# Altium schematic sheet UNIDOCK SIMPLE_2020-10-20_22-44-49.schdoc
size 286 x 136 mm
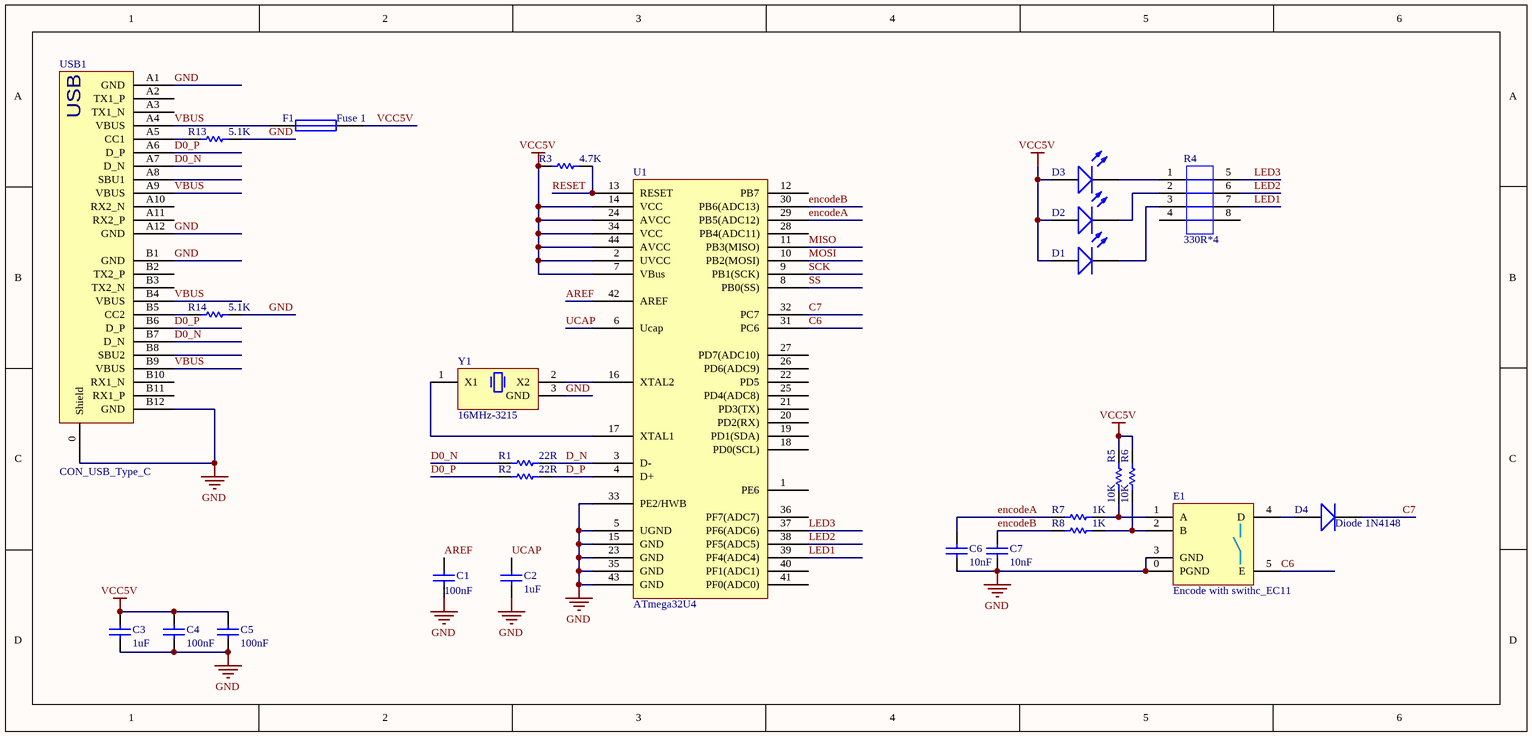
[diagram p0: UNIDOCK SIMPLE_2020-10-20_22-44-49.schdoc]

## Parts
C1  100nF  [CAPC1005L[0402]]
C2  1uF  [CAPC1005L[0402]]
C3  1uF  [CAPC1005L[0402]]
C4  100nF  [CAPC1005L[0402]]
C5  100nF  [CAPC1005L[0402]]
C6  10nF  [CAPC1005L[0402]]
C7  10nF  [CAPC1005L[0402]]
D1  LED0  [DIODE2012L[0805]]  (value not drawn)
D2  LED0  [DIODE2012L[0805]]  (value not drawn)
D3  LED0  [DIODE2012L[0805]]  (value not drawn)
D4  Diode 1N4148  [DIODE2012L[0805]]
E1  Encode with swithc_EC11  [ENCODE WITH SWITCH-EC11]
F1  Fuse 1  [CAPC1608L[0603]]
R1  22R  [RESC1005L[0402]]
R2  22R  [RESC1005L[0402]]
R3  4.7K  [RESC1005L[0402]]
R4  330R*4  [RES*4_0402]
R5  10K  [RESC1005L[0402]]
R6  10K  [RESC1005L[0402]]
R7  1K  [RESC1005L[0402]]
R8  1K  [RESC1005L[0402]]
R13  5.1K  [RESC1005L[0402]]
R14  5.1K  [RESC1005L[0402]]
U1  ATmega32U4  [44M_M]
USB1  CON_USB_Type_C  [CON_USB_TYPE-C_3.0]
Y1  16MHz-3215  [CRYSTAL SMD 3215]

## Nets
GND: C1.1 C2.2 C3.2 C4.2 C5.2 C6.1 C7.1 E1.0(PGND) E1.3(GND) R13.2 R14.2 U1.5(UGND) U1.15(GND) U1.23(GND) U1.33(PE2/HWB) U1.35(GND) U1.43(GND) USB1.0(Shield) USB1.A1(GND) USB1.A12(GND) USB1.B1(GND) USB1.B12(GND) Y1.3(GND)
VCC5V: C3.1 C4.1 C5.1 D1.1(A) D2.1(A) D3.1(A) F1.2 R3.1 R5.2 R6.2 U1.2(UVCC) U1.7(VBus) U1.14(VCC) U1.24(AVCC) U1.34(VCC) U1.44(AVCC)
AREF: C1.2 U1.42(AREF)
C6: E1.5(E) U1.31(PC6)
C7: D4.2(K) U1.32(PC7)
D0_N: R1.2 USB1.A7(D_N) USB1.B7(D_N)
D0_P: R2.2 USB1.A6(D_P) USB1.B6(D_P)
D_N: R1.1 U1.3(D-)
D_P: R2.1 U1.4(D+)
encodeA: C6.2 R7.1 U1.29(PB5(ADC12))
encodeB: C7.2 R8.1 U1.30(PB6(ADC13))
LED1: R4.7 U1.39(PF4(ADC4))
LED2: R4.6 U1.38(PF5(ADC5))
LED3: R4.5 U1.37(PF6(ADC6))
MISO: U1.11(PB3(MISO))
MOSI: U1.10(PB2(MOSI))
RESET: R3.2 U1.13(RESET)
SCK: U1.9(PB1(SCK))
SS: U1.8(PB0(SS))
UCAP: C2.1 U1.6(Ucap)
VBUS: F1.1 USB1.A4(VBUS) USB1.A9(VBUS) USB1.B4(VBUS) USB1.B9(VBUS)
NetD1_2: D1.2(K) R4.3
NetD2_2: D2.2(K) R4.2
NetD3_2: D3.2(K) R4.1
NetD4_1: D4.1(A) E1.4(D)
NetE1_1: E1.1(A) R5.1 R7.2
NetE1_2: E1.2(B) R6.1 R8.2
NetR13_1: R13.1 USB1.A5(CC1)
NetR14_1: R14.1 USB1.B5(CC2)
NetU1_16: U1.16(XTAL2) Y1.2(X2)
NetU1_17: U1.17(XTAL1) Y1.1(X1)

Not connected (* = marked no-connect by the designer): R4 4 8; U1 1(PE6) 12(PB7) 18(PD0(SCL)) 19(PD1(SDA)) 20(PD2(RX)) 21(PD3(TX)) 22(PD5) 25(PD4(ADC8)) 26(PD6(ADC9)) 27(PD7(ADC10)) 28(PB4(ADC11)) 36(PF7(ADC7)) 40(PF1(ADC1)) 41(PF0(ADC0)); USB1 A2(TX1_P) A3(TX1_N) A8(SBU1) A10(RX2_N) A11(RX2_P) B2(TX2_P) B3(TX2_N) B8(SBU2) B10(RX1_N) B11(RX1_P)

## Notes on the sheet
- (in symbol CON_USB_Type_C) USB

## Library data of the parts
C1 C4 C5 = 100nF: Published: 8-Jun-2000; LatestRevisionDate: 17-Jul-2002; LatestRevisionNote: Re-released for DXP Platform.; PackageReference: RAD-0.3; Publisher: Altium Limited
C2 C3 = 1uF: Published: 8-Jun-2000; LatestRevisionDate: 17-Jul-2002; LatestRevisionNote: Re-released for DXP Platform.; PackageReference: RAD-0.3; Publisher: Altium Limited
C6 C7 = 10nF: Published: 8-Jun-2000; LatestRevisionDate: 17-Jul-2002; LatestRevisionNote: Re-released for DXP Platform.; PackageReference: RAD-0.3; Publisher: Altium Limited
D1-D3 = LED0: Published: 8-Jun-2000; LatestRevisionDate: 08-Jul-2005; LatestRevisionNote: Mech Layer 1 removed.; PackageReference: LED-0; Publisher: Altium Limited
D4 = Diode 1N4148: Published: 8-Jun-2000; LatestRevisionDate: 17-Jul-2002; LatestRevisionNote: Re-released for DXP Platform.; DatasheetVersion: 1997; PackageReference: DO-35; Publisher: Altium Limited; Code_JEDEC: DO-204-AH; ComponentLink1Description: Manufacturer Link; ComponentLink1URL: http://www.fairchildsemi.com/; ComponentLink2Description: Datasheet; ComponentLink2URL: http://www.fairchildsemi.com/ds/1N%2F1N4148.pdf
F1 = Fuse 1: Published: 8-Jun-2000; LatestRevisionDate: 17-Jul-2002; LatestRevisionNote: Re-released for DXP Platform.; PackageReference: PIN-W2/E2.8; Publisher: Altium Limited
R1 R2 = 22R: Published: 8-Jun-2000; LatestRevisionDate: 17-Jul-2002; LatestRevisionNote: Re-released for DXP Platform.; PackageReference: AXIAL-0.3; Publisher: Altium Limited
R3 = 4.7K: Published: 8-Jun-2000; LatestRevisionDate: 17-Jul-2002; LatestRevisionNote: Re-released for DXP Platform.; PackageReference: AXIAL-0.3; Publisher: Altium Limited
R5 R6 = 10K: Published: 8-Jun-2000; LatestRevisionDate: 17-Jul-2002; LatestRevisionNote: Re-released for DXP Platform.; PackageReference: AXIAL-0.3; Publisher: Altium Limited
R7 R8 = 1K: Published: 8-Jun-2000; LatestRevisionDate: 17-Jul-2002; LatestRevisionNote: Re-released for DXP Platform.; PackageReference: AXIAL-0.3; Publisher: Altium Limited
R13 R14 = 5.1K: Published: 8-Jun-2000; LatestRevisionDate: 17-Jul-2002; LatestRevisionNote: Re-released for DXP Platform.; PackageReference: AXIAL-0.3; Publisher: Altium Limited